# EAGLE design usbpicsim (EAGLE 7.5.0)
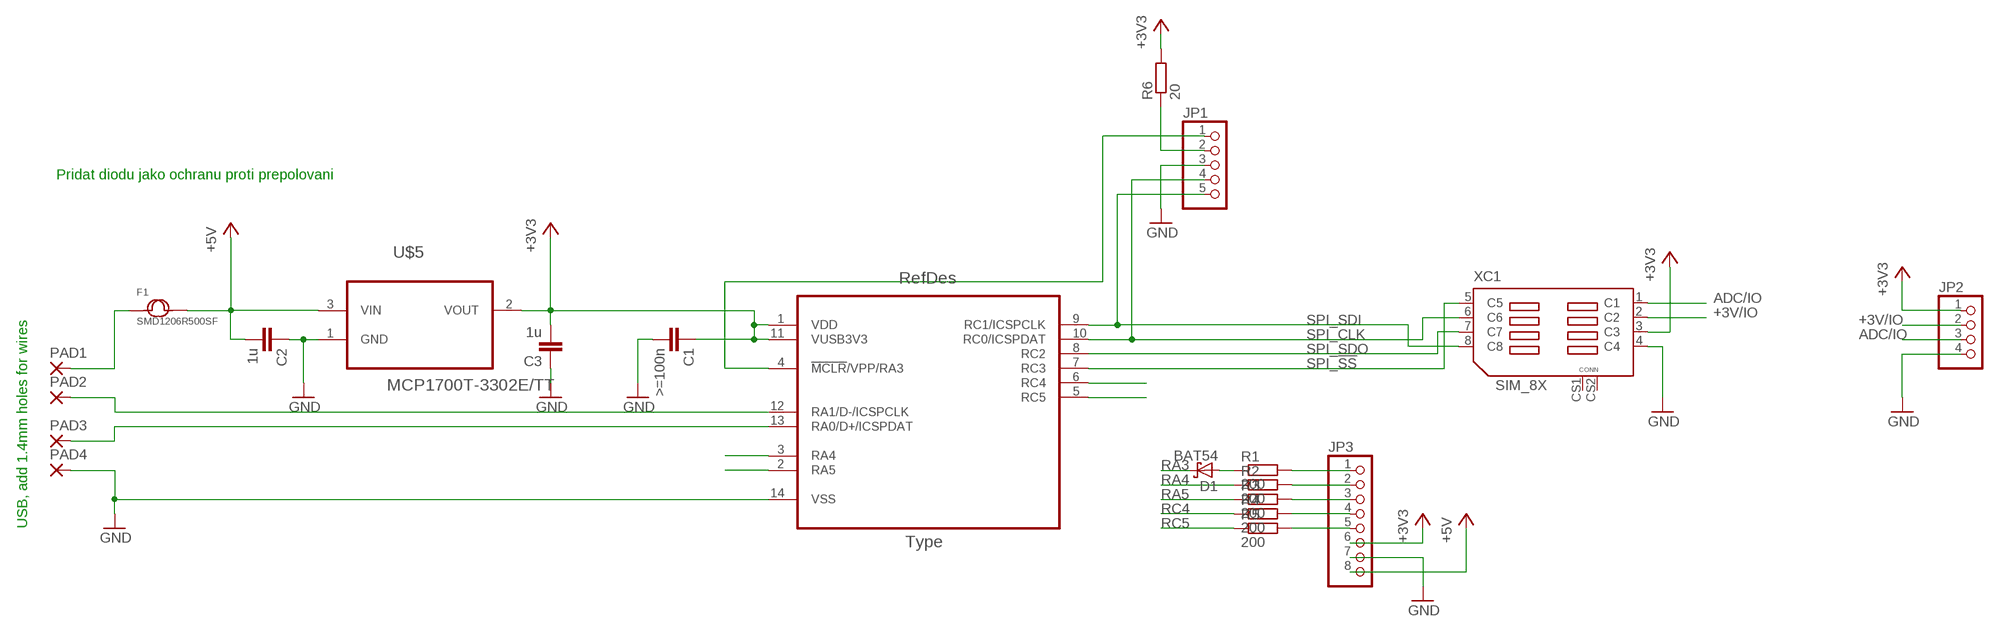
[diagram p0: schematic, sheet 1]

## Parts
C1  >=100n  C-EUC0603  [C0603]
C2  1u  C-EUC0603  [C0603]
C3  1u  C-EUC0603  [C0603]
D1  BAT54  [SOT23]
F1  SMD1206R500SF  SMD-PPTC-500MA-15V(1812)  [F1812]
JP1  PINHD-1X5  [1X05]
JP2  PINHD-1X4  [1X04]
JP3  PINHD-1X8  [1X08]
PAD1  1,6/0,9  [1,6/0,9]
PAD2  1,6/0,9  [1,6/0,9]
PAD3  1,6/0,9  [1,6/0,9]
PAD4  1,6/0,9  [1,6/0,9]
R1  200  R-EU_R0603  [R0603]
R2  200  R-EU_R0603  [R0603]
R3  200  R-EU_R0603  [R0603]
R4  200  R-EU_R0603  [R0603]
R5  200  R-EU_R0603  [R0603]
R6  20  R-EU_R0603  [R0603]
U1  PIC16LF1455-I/ST  [SOP65P640X120-14N]
U$5  MCP1700T-3302E/TT  [SOT95P237X112-3N]
XC1  SIM_8X  [SIM_8XPADS]

## Nets
+3V3: C1.1 C3.2 JP2.1 JP3.6 R6.2 U1.1(VDD) U1.11(VUSB3V3) U$5.2(VOUT) XC1.3(C3)
+3V/IO: JP2.2 XC1.2(C2)
+5V: C2.2 F1.2 JP3.8 U$5.3(VIN)
ADC/IO: JP2.3 XC1.1(C1)
GND: C1.2 C2.1 C3.1 JP1.3 JP2.4 JP3.7 PAD4.1(P) U1.14(VSS) U$5.1(GND) XC1.4(C4)
N$1: JP3.3 R3.2
N$2: PAD3.1(P) U1.13(RA0/D+/ICSPDAT)
N$3: PAD2.1(P) U1.12(RA1/D-/ICSPCLK)
N$4: JP3.5 R5.2
N$5: F1.1 PAD1.1(P)
N$7: JP3.2 R2.2
N$8: JP3.4 R4.2
N$9: JP1.2 R6.1
RA3: D1.3(C) JP1.1 U1.4(!MCLR!/VPP/RA3)
RA3@1: D1.1(A) R1.1
RA3@2: JP3.1 R1.2
RA4: R2.1 U1.3(RA4)
RA5: R3.1 U1.2(RA5)
RC4: R4.1 U1.6(RC4)
RC5: R5.1 U1.5(RC5)
SPI_!SS: U1.7(RC3) XC1.5(C5)
SPI_CLK: JP1.4 U1.10(RC0/ICSPDAT) XC1.6(C6)
SPI_SDI: JP1.5 U1.9(RC1/ICSPCLK) XC1.8(C8)
SPI_SDO: U1.8(RC2) XC1.7(C7)
Unconnected: XC1.CS1 XC1.CS2

## Notes on the sheet
- Pridat diodu jako ochranu proti prepolovani
- USB, add 1.4mm holes for wires

## Library data of the parts
C1-C3 = rcl:C-EU: CAPACITOR, European symbol
D1 = diode:BAT54: Schottky Diodes Source: Fairchild .. BAT54.pdf
F1 = tagps:SMD-PPTC-500MA-15V(1812): 307010007; MPN: SMD1206R500SF
JP1 = pinhead:PINHD-1X5: PIN HEADER
JP2 = pinhead:PINHD-1X4: PIN HEADER
JP3 = pinhead:PINHD-1X8: PIN HEADER
PAD1-PAD4 = wirepad:1,6/0,9: THROUGH-HOLE PAD
R1-R6 = tagps:R-EU_: RESISTOR, European symbol; SPICEPREFIX: R
U1 = usbpiclib:PIC16LF1455-I/ST: 8-Bit USB Microcontrollers,14TSSOP; MPN: PIC16LF1455-I/ST; OC_FARNELL: 2313762; OC_NEWARK: 83T7233; PACKAGE: TSSOP-14; SUPPLIER: MICROCHIP
U$5 = usbpiclib:MCP1700T-3302E/TT: Low Quiescent Current LDO; MPN: MCP1700T-3302E/TT; OC_FARNELL: 1296592; OC_NEWARK: 88H9817; PACKAGE: SOT23-3; SUPPLIER: Microchip
XC1 = usbpiclib:SIM_8X

## Board
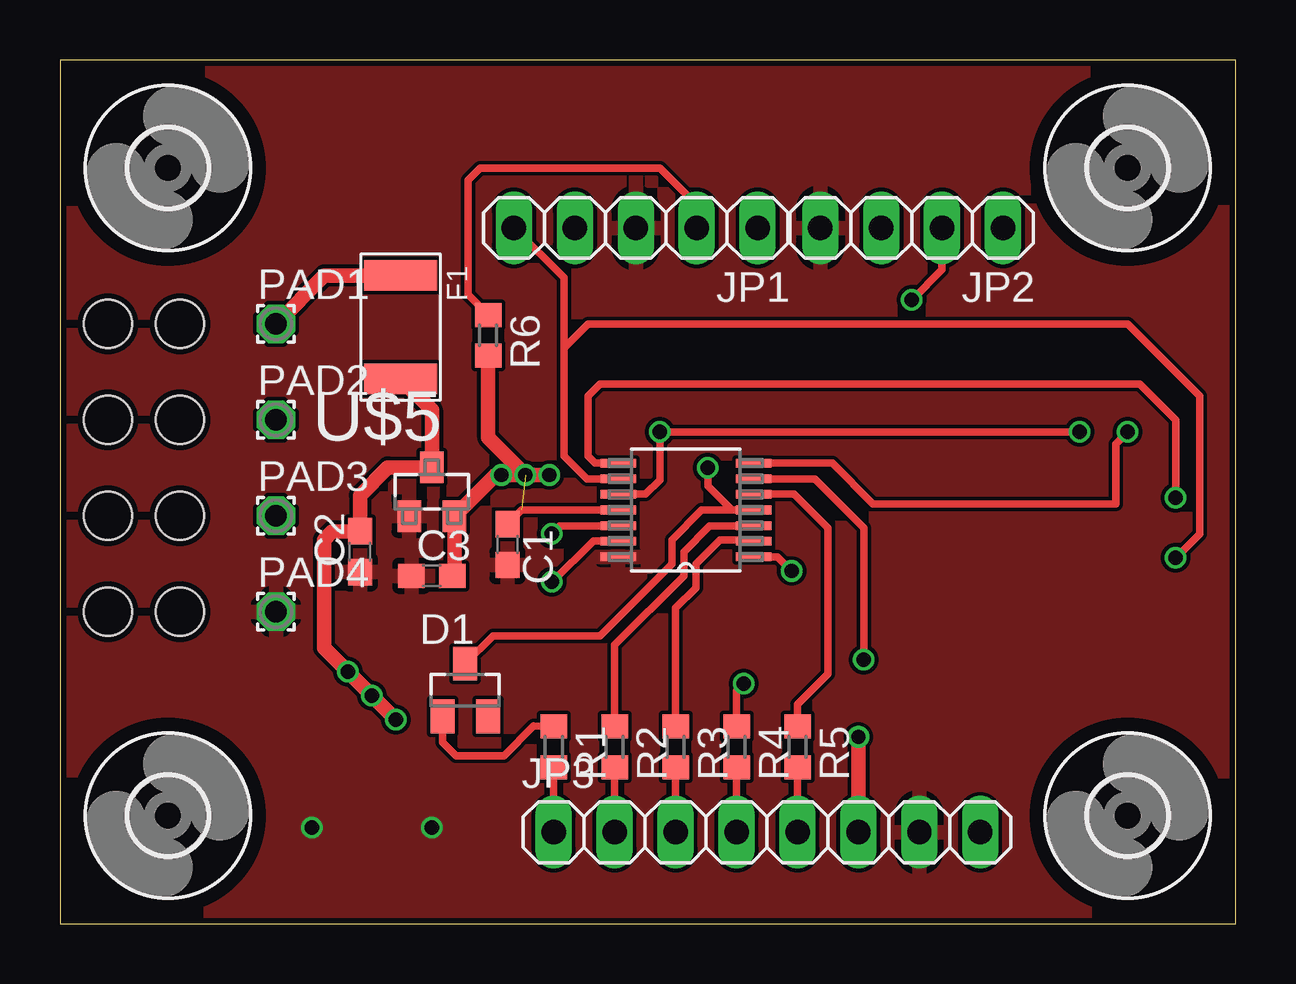
[diagram p1: board, top side]
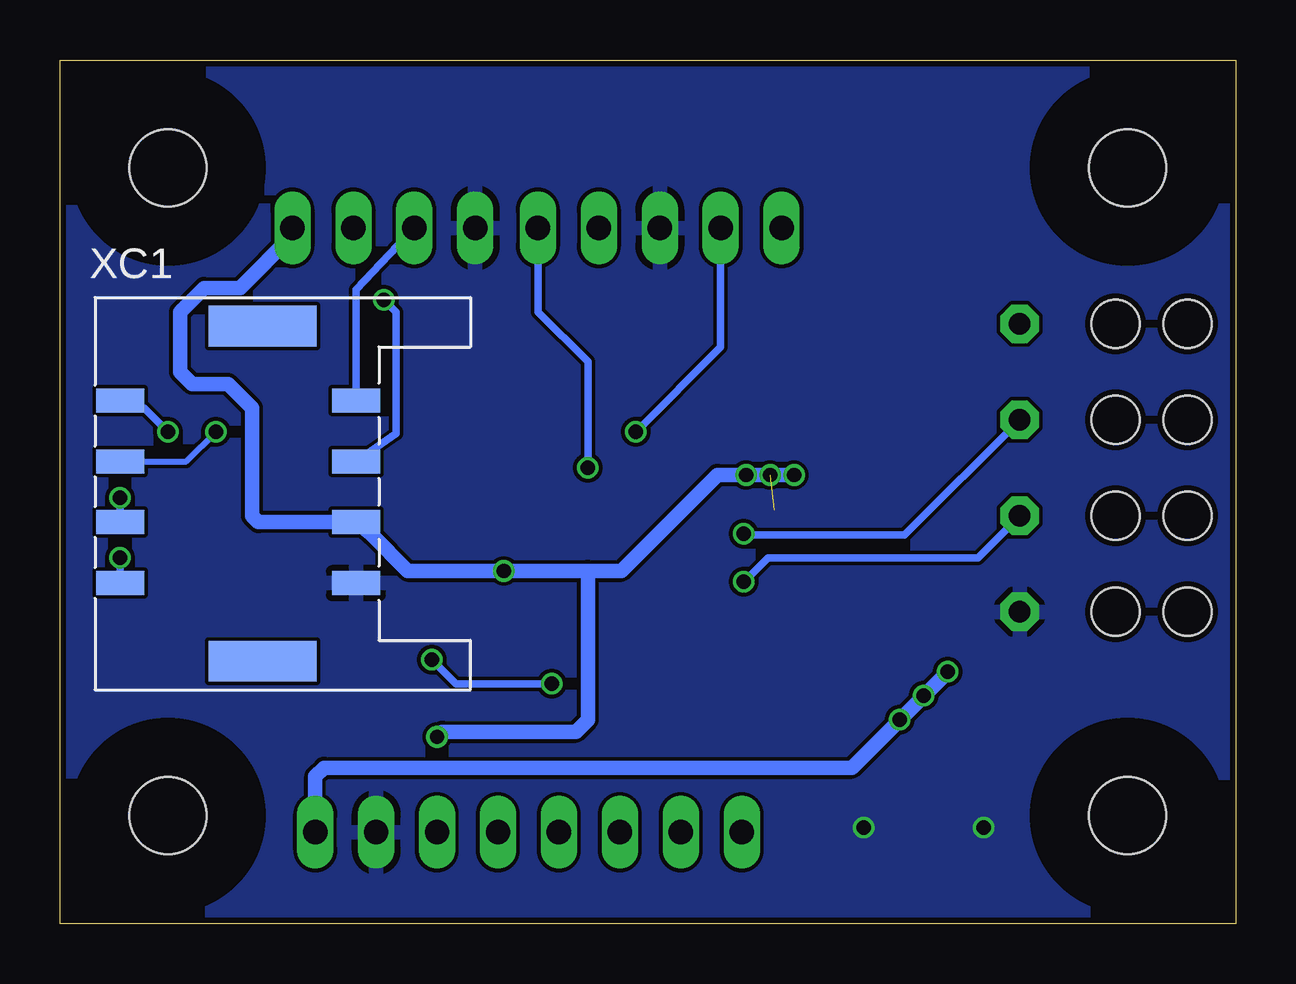
[diagram p2: board, bottom side, seen from below]

Size 49 x 36 mm. Coordinates in mm from the lower left corner, seen from the top.
Outline: 0,0 49,0 49,36 0,36 0,0
Copper layers (1*16): Top 0.035mm / dielectric 1.5mm / Bottom 0.035mm
Design rules "SeeedStudio_2layer_DRU_no_angle_20140221 *": minimum track width 6mil, minimum drill 12mil, track to track 6mil, track to pad 6mil, pad to pad 6mil, via to via 6mil, smd to smd 6mil, copper to edge 10mil, drill to drill 10mil, minimum pad ring 10mil, minimum via ring 6mil, stop-mask expansion 2mil, vias tented up to drill 100mil, thermal gap 10mil
Holes 2 mm at 5,25 5,21 5,17 5,13 2,25 2,21 2,17 2,13

### Footprints (pad centres in the part's own frame; a part is rotated, then mirrored left to right if it is on the bottom)
C0603 = smd 1.1 x 1: 1 -0.85,0; 2 0.85,0
SOT23 = smd 1 x 1.4: 1 -0.95,-1.1; 2 0.95,-1.1; 3 0,1.1
F1812 = smd 1.27 x 3.048: 1 -2.159,0; 2 2.159,0
1X05 = drill 1.016 long: 1 -5.08,0; 2 -2.54,0; 3 0,0; 4 2.54,0; 5 5.08,0
1X04 = drill 1.016 long: 1 -3.81,0; 2 -1.27,0; 3 1.27,0; 4 3.81,0
1X08 = drill 1.016 long: 1 -8.89,0; 2 -6.35,0; 3 -3.81,0; 4 -1.27,0; 5 1.27,0; 6 3.81,0; 7 6.35,0; 8 8.89,0
1,6/0,9 = drill 0.914 pad 1.6 octagon: 1 0,0
R0603 = smd 1 x 1.1: 1 -0.85,0; 2 0.85,0
SOP65P640X120-14N = smd 1.473 x 0.356: 1 -2.819,1.956; 2 -2.819,1.295; 3 -2.819,0.66; 4 -2.819,0; 5 -2.819,-0.66; 6 -2.819,-1.295; 7 -2.819,-1.956; 8 2.819,-1.956; 9 2.819,-1.295; 10 2.819,-0.66; 11 2.819,0; 12 2.819,0.66; 13 2.819,1.295; 14 2.819,1.956
3,2 = hole 3.2: 0,0
SOT95P237X112-3N = smd 0.991 x 1.321: 1 -0.94,-1.016; 2 0.94,-1.016; 3 0,1.016
SIM_8XPADS = smd 2 x 1: 1 9.842,3.81; 2 9.842,1.27; 3 9.842,-1.27; 4 9.842,-3.81; 5 0,3.81; 6 0,1.27; 7 0,-1.27; 8 0,-3.81 | smd 4.5 x 1.7: CS1 5.953,6.906; CS2 5.953,-7.064

### Placement (x,y rotation side)
C1  18.65,15.8 270 top
C2  12.5,15.5 90 top
C3  15.5,14.5 0 top
D1  16.89,9.73 0 top
F1  14.2,24.86 270 top
JP1  24,29 180 top
JP2  35.5,29 180 top
JP3  29.47,3.81 0 top
PAD1  9,25 0 top
PAD2  9,21 0 top
PAD3  9,17 0 top
PAD4  9,13 0 top
R1  20.58,7.37 270 top
R2  23.12,7.37 270 top
R3  25.66,7.37 270 top
R4  28.2,7.37 270 top
R5  30.74,7.37 270 top
R6  17.85,24.52 270 top
U1  26.09,17.24 180 top
U$1  [3,2]  4.5,31.5 0 top
U$2  [3,2]  4.5,4.5 0 top
U$3  [3,2]  44.5,31.5 0 top
U$4  [3,2]  44.5,4.5 0 top
U$5  15.5,18 0 top
XC1  46.5,18 0 bottom

### Tracks (layer width: path | path; a pad name or v marks a point on that pad's centre or on a via)
+3V3  (via drill 0.6)  (1 unrouted)
  Top 0.305: U1.11 19.24,17.24 C1.1 | U1.1 29.92,15.28 v30.5,14.7
  Top 0.61: v33.28,7.78 JP3.6 | v19.4,18.7 17.85,20.25 R6.2 | v19.4,18.7 18.16,18.7 U$5.2 16.44,14.59 C3.2 | v19.4,18.7 v20.4,18.7
  Bottom 0.61: 27,14.7 v30.5,14.7 34.51,14.7 36.04,16.23 XC1.3 40.73,16.73 41,17 41,21.5 42,22.5 43.5,22.5 44,23 44,25.5 43,26.5 41.5,26.5 39.31,28.69 JP2.1 | 27,14.7 25.6,14.7 21.6,18.7 v19.4,18.7 v18.4,18.7 | 27,14.7 27,8.5 27.5,8 33.06,8 v33.28,7.78
+3V/IO  (via drill 0.6)
  Top 0.305: v35.5,26 36.77,27.27 JP2.2
  Bottom 0.305: XC1.2 35,20.43 35,25.5 v35.5,26
+5V  (via drill 0.6)
  Top 0.61: F1.2 15.5,21.4 U$5.3 13.67,19.02 12.5,17.85 C2.2 11.35,16.35 11,16 11,11.5 v12,10.5 v13,9.5 v14,8.5
  Bottom 0.61: JP3.8 38.36,6.14 38,6.5 16,6.5 v12,10.5
ADC/IO
  Bottom 0.305: JP2.3 36.66,26.43 XC1.1
GND  (via drill 0.6)
  other vias: 10.5,4 15.5,4
  pour Top: 0,-0.5 55.5,-0.5 55.5,37 0,37
  pour Bottom: 0,0 55.5,0 55.5,37.5 0,37.5
N$1
  Top 0.305: JP3.3 R3.2
N$2  (via drill 0.6)
  Top 0.305: U1.13 22.25,15.95 v20.5,14.25
  Bottom 0.305: PAD3.1 10.75,15.25 19.5,15.25 v20.5,14.25
N$3  (via drill 0.6)
  Top 0.305: v20.5,16.25 20.83,16.58 U1.12
  Bottom 0.305: PAD2.1 13.8,16.2 20.45,16.2 v20.5,16.25
N$4
  Top 0.305: JP3.5 R5.2
N$5
  Top 0.61: F1.1 11.02,27.02 PAD1.1
N$7
  Top 0.305: JP3.2 R2.2
N$8
  Top 0.305: JP3.4 R4.2
N$9
  Top 0.305: R6.1 17,26.22 17,31 17.5,31.5 25,31.5 26.54,29.96 JP1.2
RA3  (via drill 0.6)
  Top 0.305: U1.4 28,17.24 | 28,17.24 26.74,17.24 25.5,16 25.5,15 22.5,12 18.05,12 D1.3 | v27,19 27,18.24 28,17.24
  Bottom 0.305: v27,19 27,23.42 29.08,25.5 JP1.1
RA3@1
  Top 0.305: D1.1 15.94,7.56 16.5,7 18.5,7 19.73,8.23 R1.1
RA3@2
  Top 0.305: R1.2 JP3.1
RA4
  Top 0.305: U1.3 27.08,16.58 26,15.5 26,14.5 23.12,11.62 R2.1
RA5
  Top 0.305: U1.2 28.85,16 27.5,16 26.5,15 26.5,14 25.66,13.16 R3.1
RC4  (via drill 0.6)
  Top 0.305: U1.6 31.46,18.54 33.5,16.5 v33.5,11 | R4.1 28.2,9.7 v28.5,10
  Bottom 0.305: v33.5,11 32.5,10 v28.5,10
RC5
  Top 0.305: U1.5 30.6,17.9 32,16.5 32,10.43 32.01,10.41 30.74,9.14 R5.1
SPI_!SS  (via drill 0.6)
  Top 0.305: U1.7 32.2,19.2 33.89,17.5 44,17.5 44,20 v44.5,20.5
  Bottom 0.305: v44.5,20.5 45.5,21.5 46.31,21.5 XC1.5
SPI_CLK  (via drill 0.6)
  Top 0.305: U1.10 24.4,17.9 25,18.5 v25,20.5 v42.5,20.5
  Bottom 0.254: XC1.6 43.73,19.27 v42.5,20.5
  Bottom 0.305: v25,20.5 21.46,24.04 JP1.4
SPI_SDI  (via drill 0.6)
  Top 0.305: U1.9 21.96,18.54 21,19.5 21,24 | 21,24 22,25 44.5,25 47.5,22 47.5,16.25 v46.5,15.25 | JP1.5 21,26.92 21,24
  Bottom 0.305: XC1.8 v46.5,15.25
SPI_SDO  (via drill 0.6)
  Top 0.305: U1.8 22.3,19.2 22,19.5 22,22 22.5,22.5 45,22.5 46.5,21 v46.5,17.75
  Bottom 0.305: v46.5,17.75 XC1.7

### Text on the board
tDocu: ------- | prog | ICLK | IDAT | GND | 3V3 | VPP | GND | ADC/IO | 3V/IO | 3V3 | USBVDD | D- | D+ | GND | RA3 | RA4 | RA5 | RC4 | RC5 | 3V3 | GND | 5V | USBPIC v1.0 r2016